# Altium schematic sheet power.SchDoc
size A; SheetNumber: 1; SheetTotal: 2
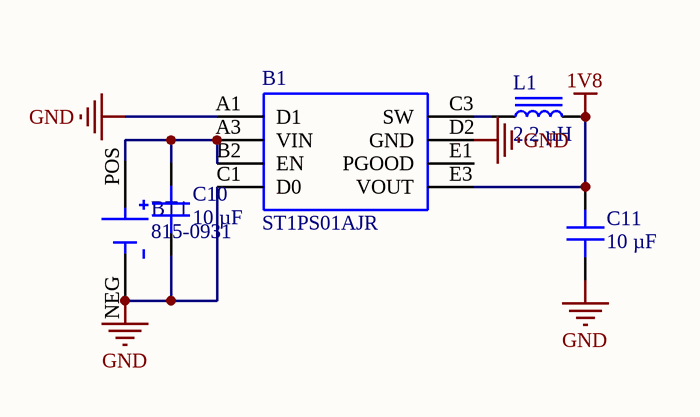
[diagram p0: power.SchDoc]

## Parts
B1  ST1PS01AJR  [ST1PS01AJR]
BT1  815-0931  [BAT_815-0931]
C10  10 µF  [CAP 0603_1608]
C11  10 µF  [CAP 0603_1608]
L1  2.2 µH  [TDK VLS201612CX]

## Nets
1V8: B1.E3(VOUT) C11.2 L1.2
GND: B1.A1(D1) B1.C1(D0) B1.D2(GND) BT1.NEG C10.1 C11.1
NetB1_A3: B1.A3(VIN) B1.B2(EN) BT1.POS C10.2
NetB1_C3: B1.C3(SW) L1.1

Not connected (* = marked no-connect by the designer): B1 E1(PGOOD)

## Library data of the parts
B1 = ST1PS01AJR: Switching Voltage Regulators 400 mA nano-quiescent synchronous step-down converter digital volt selection & P; Manufacturer_Name: STMicroelectronics; Geometry.Height: 0.6mm; Manufacturer_Part_Number: ST1PS01AJR; Mouser Part Number: 511-ST1PS01AJR; Mouser Price/Stock: https://www.mouser.co.uk/ProductDetail/STMicroelectronics/ST1PS01AJR?qs=P19jvy6W2mdx%252Bu2ylwJ4Uw%3D%3D; Arrow Part Number: ST1PS01AJR; Arrow Price/Stock: https://www.arrow.com/en/products/st1ps01ajr/stmicroelectronics?region=nac; Mouser Testing Part Number: *; Mouser Testing Price/Stock: *; Datasheet Link: https://www.st.com/resource/en/datasheet/st1ps01.pdf
BT1 = 815-0931: Holder 1/2aa Battery w/o Cover; Package: None; Price: None; Value: *; MP: 815-0931; Availability: Unavailable
C10 C11 = GRM188R60J106ME47D: CAP CER 10UF 6.3V X5R 0603; manufacturer: Murata Electronics; Tolerance: ±20%; Part Number: GRM188R60J106ME47D; Value: 10 µF; Applications: General Purpose; Capacitance: 10 µF; componentlink1description: Datasheet; componentlink1url: https://www.murata.com/~/media/webrenewal/support/library/catalog/products/capacitor/mlcc/c02e.ashx?la=en-us; componentlink2description: DigiKey Link; componentlink2url: https://www.digikey.com/en/products/detail/murata-electronics/GRM188R60J106ME47D/965910; Device Package: 0603 (1608 Metric); lastupdated: 11/9/2022 9:40:24 am; Lifecycle Status: Active; Minimum Order: 1; Mounting Type: Surface Mount, MLCC; Operating Temperature: -55°C ~ 85°C; Package / Case: 0603 (1608 Metric); packaging: TapeAndReel; partid: 2351; Part Status: Active; price: 0.02; series: GRM; Size / Dimension: 0.063" L x 0.031" W (1.60mm x 0.80mm); Supplier 1: DigiKey; Supplier Part Number 1: 490-3896-1-ND; Temperature Coefficient: X5R; Thickness (Max): 0.035" (0.90mm); Voltage - Rated: 6.3V
L1 = VLS201612CX-6R8M-1: FIXED IND 6.8UH 930MA 368MOHM SM; Manufacturer: TDK Corporation; Current - Saturation: 730mA; DC Resistance (DCR): 368mOhm Max; Inductance: 6.8 µH; Inductance Frequency - Test: 1 MHz; Material - Core: Ferrite; Shielding: Shielded; Tolerance: ±20%; Type: Drum Core, Wirewound; Part Number: VLS201612CX-6R8M-1; ComponentLink1Description: Datasheet; ComponentLink1URL: https://product.tdk.com/info/en/catalog/datasheets/inductor_commercial_power_vls201612cx-1_en.pdf?ref_disty=digikey; ComponentLink2Description: DigiKey Link; ComponentLink2URL: https://www.digikey.com/en/products/detail/tdk-corporation/VLS201612CX-6R8M-1/5169771; Current Rating (Amps): 930 mA; Device Package: Nonstandard; Height - Seated (Max): 0.047" (1.20mm); LastUpdated: 11/9/2022 10:31:03 am; Lifecycle Status: Active; Minimum Order: 1; Mounting Type: Surface Mount; Operating Temperature: -40°C ~ 105°C; Package / Case: Nonstandard; Packaging: TapeAndReel; PartId: 207; Part Status: Active; Price: 0.13; Series: VLS-CX-1; Size / Dimension: 0.079" L x 0.063" W (2.00mm x 1.60mm); Supplier 1: DigiKey; Supplier Part Number 1: 445-172966-1-ND; Supplier Device Package: 2016; Value: 2.2 µH